# Altium project lab1.PrjPcb
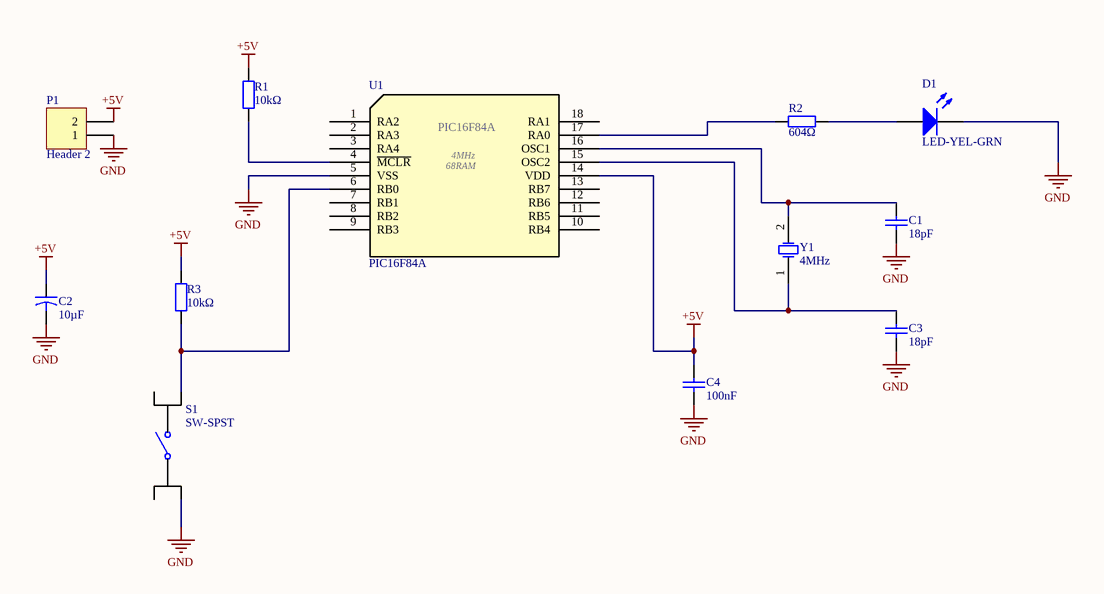
[diagram p0: Sheet1.SchDoc]
1 sheet, 12 parts. Net scope: global (net labels, ports and power ports of the same name join across sheets).
Board file: PCB1.PcbDoc

## Sheet Sheet1.SchDoc
size A4

### Parts
C1  18pF  [capacitor0603nopolar]
C2  Capacity: 10µF  [cappolar_CM1H106M6L006VR]  (hidden comment: Cap 10uF)
C3  18pF  [capacitor0603nopolar]
C4  100nF  [capacitor0603nopolar]
D1  LED-YEL-GRN  [diode0603]
P1  Header 2  [header2,54]
R1  10kΩ  [resistor0603]
R2  604Ω  [resistor0603]
R3  10kΩ  [resistor0603]
S1  SW-SPST  [switch]
U1  PIC16F84A  [DIP18]
Y1  4MHz  [oscilator_XTAL003071]

### Nets
+5V: C2.1 C4.2 P1.2 R1.2 R3.2 U1.14(VDD)
GND: C1.1 C2.2 C3.1 C4.1 D1.2(K) P1.1 S1.2(NO) U1.5(VSS)
NetC1_2: C1.2 U1.16(OSC1) Y1.2(OSC2)
NetC3_2: C3.2 U1.15(OSC2) Y1.1(OSC1)
NetD1_1: D1.1(A) R2.2
NetR1_1: R1.1 U1.4(~{MCLR})
NetR2_1: R2.1 U1.17(RA0)
NetR3_1: R3.1 S1.4(NO) U1.6(RB0)

Not connected (* = marked no-connect by the designer): S1 1(NO) 3(NO); U1 1(RA2) 2(RA3) 3(RA4) 7(RB1) 8(RB2) 9(RB3) 10(RB4) 11(RB5) 12(RB6) 13(RB7) 18(RA1)

### Notes on the sheet
- (in symbol PIC16F84A) 68RAM

### Library data of the parts
C1 C3 = Cap 18pF: Capacitor; Manufacturer: WALSIN; Manufacturer symbol: 0603N180G500CT; Voltage: 50V; Tolerance: ±2%; Supplier symbol: 0603N180G500CT; Supplier: tme.pl; Package: 0603; Temperature: -55...125°C; Value: 18pF
C2 = Cap 10uF: Capacitor; Manufacturer symbol: CM1H106M6L006VR; Manufacturer: SAMWHA; Tolerance: ±20%; Voltage: 50V; Temperature: -55...105°C; Supplier symbol: CM1H106M6L006VR; Supplier: tme.pl; Size: Ø6,3x5,8mm
C4 = Cap 100nF: Capacitor; Manufacturer: WALSIN; Manufacturer symbol: 0603B104K101CT; Voltage: 100V; Tolerance: ±10%; Supplier symbol: 0603B104K101CT; Supplier: tme.pl; Package: 0603; Temperature: -55...125°C; Value: 100nF
D1 = LED-YEL-GRN: Typical INFRARED GaAs LED; Manufacturer symbol: 19-21SYGC/S530-E1/4T; Manufacturer: EVERLIGHT; Color: żółto-zielony; Current: 20mA; Voltage: 1,7...2,4V; Supplier symbol: 19-21SYGC/S530-E1; Supplier: tme.pl; Package: 0603
P1 = Header 2: Header, 2-Pin; Manufacturer: TE CONNECTIVITY; Manufacturer symbol: 825433-2; Montage: THT; Supplier: tme.pl; Supplier symbol: 825433-2; Type: Male; Pins: 2; Orientation: Straight
R1 R3 = Resistor 10Kohm: Resistor; Manufacturer: ROYAL OHM; Manufacturer symbol: HP03W5F1002T5E; Montage: SMD; Tolerance: ±1%; Voltage: 50V; Supplier symbol: HP03-10K1%; Supplier: tme.pl; Type: thick film; Resistance: 10kΩ; Temperature: -55...155°C; Package: 0603
R2 = Resistor 604ohm: Resistor; Manufacturer: WALSIN; Manufacturer symbol: WR06X6040FTL; Montage: SMD; Tolerance: ±1%; Voltage: 75V; Supplier symbol: WR06X6040FTL; Supplier: tme.pl; Type: thick film; Temperature: -55...155°C; Package: 0603; Resistance: 604Ω
S1 = SW-SPST: Single-Pole, Single-Throw Switch; Manufacturer symbol: HP0315AFKP2-S; Manufacturer: NKK SWITCHES; Supplier: tme.pl; Supplier symbol: HP0315AFKP2-S; Temperature: -20...70°C; Dimensions: 6,2x6,2x4,4mm; Height: 4,4mm
U1 = PIC16F84A: Microchip; Manufacturer: MICROCHIP TECHNOLOGY; Manufacturer symbol: PIC16F84A-04/P; Voltage: 4...5,5V DC; Frequency: 4MHz; Montage: THT; Supplier: tme.pl; Supplier symbol: PIC16F84A-04/P; Temperature: 0..70°C; Package: DIP18
Y1 = Oscylator 4MHz: Crystal Oscillator; Manufacturer: IQD FREQUENCY PRODUCTS; Manufacturer symbol: LF XTAL003071; Capacity: 16pF; Power: 0,5mW; Montage: SMD; Supplier symbol: 4.00M-SMDHC49R; Supplier: tme.pl; Frequency: 4MHz; Package: HC49SM; Temperature: -10...60°C